# Altium schematic sheet WL-BPF_L.SchDoc
size 420 x 297 mm; Scale: 1:1; DocumentType: Схема электрическая принципиальная; FirstReferrence: АБВГ.123456.001; DocumentNumber: 11; SheetNumber: 12; SheetTotal: 12
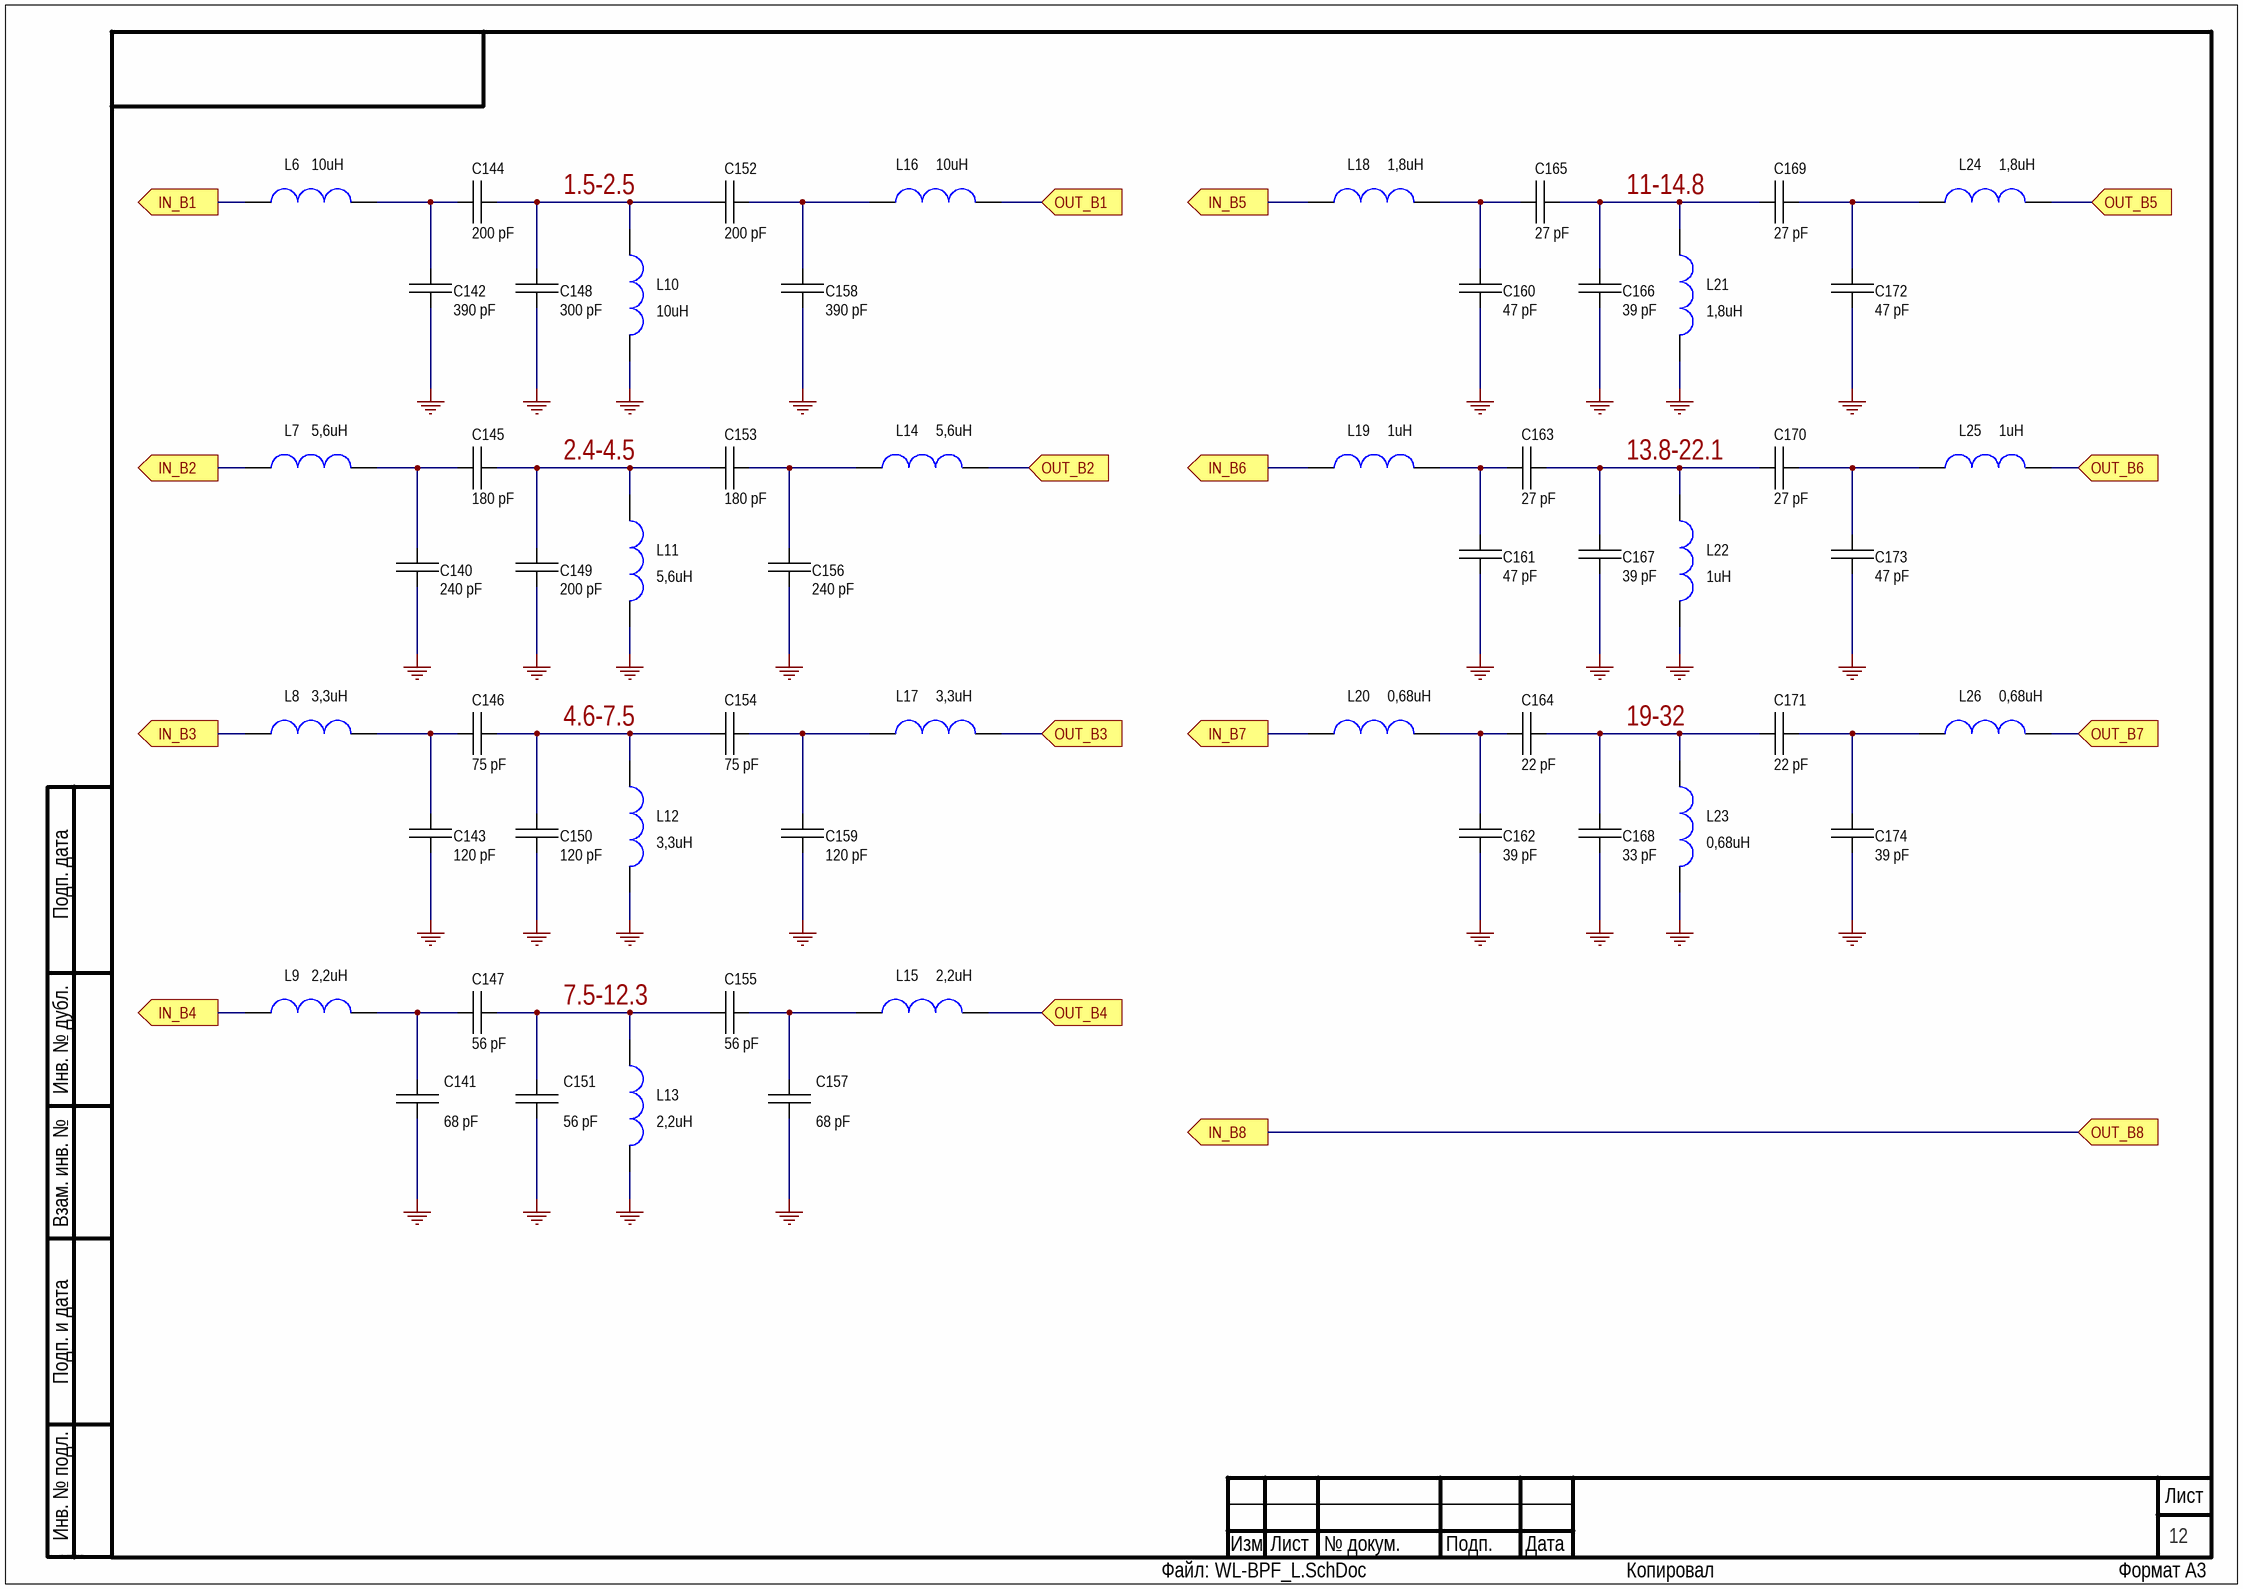
[diagram p0: WL-BPF_L.SchDoc]

## Parts
C140  240 pF  [C-0805-0.7]
C141  68 pF  [C-0805-0.7]
C142  390 pF  [C-0805-0.7]
C143  120 pF  [C-0805-0.7]
C144  200 pF  [C-0805-0.7]
C145  180 pF  [C-0805-0.7]
C146  75 pF  [C-0805-0.7]
C147  56 pF  [C-0805-0.7]
C148  300 pF  [C-0805-0.7]
C149  200 pF  [C-0805-0.7]
C150  120 pF  [C-0805-0.7]
C151  56 pF  [C-0805-0.7]
C152  200 pF  [C-0805-0.7]
C153  180 pF  [C-0805-0.7]
C154  75 pF  [C-0805-0.7]
C155  56 pF  [C-0805-0.7]
C156  240 pF  [C-0805-0.7]
C157  68 pF  [C-0805-0.7]
C158  390 pF  [C-0805-0.7]
C159  120 pF  [C-0805-0.7]
C160  47 pF  [C-0805-0.7]
C161  47 pF  [C-0805-0.7]
C162  39 pF  [C-0805-0.7]
C163  27 pF  [C-0805-0.7]
C164  22 pF  [C-0805-0.7]
C165  27 pF  [C-0805-0.7]
C166  39 pF  [C-0805-0.7]
C167  39 pF  [C-0805-0.7]
C168  33 pF  [C-0805-0.7]
C169  27 pF  [C-0805-0.7]
C170  27 pF  [C-0805-0.7]
C171  22 pF  [C-0805-0.7]
C172  47 pF  [C-0805-0.7]
C173  47 pF  [C-0805-0.7]
C174  39 pF  [C-0805-0.7]
L6  10uH  [L-1210]
L7  5,6uH  [L-1210]
L8  3,3uH  [L-1210]
L9  2,2uH  [L-1210]
L10  10uH  [L-1210]
L11  5,6uH  [L-1210]
L12  3,3uH  [L-1210]
L13  2,2uH  [L-1210]
L14  5,6uH  [L-1210]
L15  2,2uH  [L-1210]
L16  10uH  [L-1210]
L17  3,3uH  [L-1210]
L18  1,8uH  [L-1210]
L19  1uH  [L-1210]
L20  0,68uH  [L-1210]
L21  1,8uH  [L-1210]
L22  1uH  [L-1210]
L23  0,68uH  [L-1210]
L24  1,8uH  [L-1210]
L25  1uH  [L-1210]
L26  0,68uH  [L-1210]

## Ports
IN_B1 (out), IN_B2 (out), IN_B3 (out), IN_B4 (out), IN_B5 (out), IN_B6 (out), IN_B7 (out), IN_B8 (out), OUT_B1 (in), OUT_B2 (in), OUT_B3 (in), OUT_B4 (in), OUT_B5 (in), OUT_B6 (in), OUT_B7 (in), OUT_B8 (in)

## Nets
GND: C140.1 C141.1 C142.1 C143.1 C148.1 C149.1 C150.1 C151.1 C156.1 C157.1 C158.1 C159.1 C160.1 C161.1 C162.1 C166.1 C167.1 C168.1 C172.1 C173.1 C174.1 L10.2 L11.2 L12.2 L13.2 L21.2 L22.2 L23.2
IN_B1: L6.1 ; port IN_B1
IN_B2: L7.1 ; port IN_B2
IN_B3: L8.1 ; port IN_B3
IN_B4: L9.1 ; port IN_B4
IN_B5: L18.1 ; port IN_B5
IN_B6: L19.1 ; port IN_B6
IN_B7: L20.1 ; port IN_B7
IN_B8: port IN_B8, port OUT_B8
OUT_B1: L16.2 ; port OUT_B1
OUT_B2: L14.2 ; port OUT_B2
OUT_B3: L17.2 ; port OUT_B3
OUT_B4: L15.2 ; port OUT_B4
OUT_B5: L24.2 ; port OUT_B5
OUT_B6: L25.2 ; port OUT_B6
OUT_B7: L26.2 ; port OUT_B7
NetC140_2: C140.2 C145.1 L7.2
NetC141_2: C141.2 C147.2 L9.2
NetC142_2: C142.2 C144.1 L6.2
NetC143_2: C143.2 C146.1 L8.2
NetC144_2: C144.2 C148.2 C152.1 L10.1
NetC145_2: C145.2 C149.2 C153.1 L11.1
NetC146_2: C146.2 C150.2 C154.1 L12.1
NetC147_1: C147.1 C151.2 C155.2 L13.1
NetC152_2: C152.2 C158.2 L16.1
NetC153_2: C153.2 C156.2 L14.1
NetC154_2: C154.2 C159.2 L17.1
NetC155_1: C155.1 C157.2 L15.1
NetC160_2: C160.2 C165.1 L18.2
NetC161_2: C161.2 C163.1 L19.2
NetC162_2: C162.2 C164.1 L20.2
NetC163_2: C163.2 C167.2 C170.1 L22.1
NetC164_2: C164.2 C168.2 C171.1 L23.1
NetC165_2: C165.2 C166.2 C169.1 L21.1
NetC169_2: C169.2 C172.2 L24.1
NetC170_2: C170.2 C173.2 L25.1
NetC171_2: C171.2 C174.2 L26.1

## Notes on the sheet
- 1.5-2.5
- 11-14.8
- 2.4-4.5
- (near C170) 13.8-22.1
- 4.6-7.5
- 19-32
- 7.5-12.3
- Подп. дата
- Инв. № дубл.
- Взам. инв. №
- Подп. и дата
- Инв. № подл.
- Изм.
- Лист
- № докум.
- Подп.
- Дата
- ALTIUM GOSTBOM2.0 KEV
- Файл:
- Копировал
- Формат А3

## Library data of the parts
C140 C156 = CC0805JRNPO9BN241: Manufacturer: Yageo; Type: Конденсатор; Dielectric: NPO; Value: 240; Tolerance: ±5%; Voltage: 50 V; CommentDOC: ( CC - 0805 - NPO - 50 V - 240 pF ±5% ); Part Number: CC0805JRNPO9BN241; Units: pF; Case: 0805; Operating Temperature: -55 ... 125 °C; Series: CC; Value+Units: 240 pF; ValueSCH: 240 pF; ( Series - Case - Dielectric -  Voltage - Value+Units Tolerance: ( CC - 0805 - NPO - 50 V - 240 pF ±5% )
C141 C157 = CC0805JRNPO9BN680: Manufacturer: Yageo; Type: Конденсатор; Dielectric: NPO; Value: 68; Tolerance: ±5%; Voltage: 50 V; CommentDOC: ( CC - 0805 - NPO - 50 V - 68 pF ±5% ); Part Number: CC0805JRNPO9BN680; Units: pF; Case: 0805; Operating Temperature: -55 ... 125 °C; Series: CC; Value+Units: 68 pF; ValueSCH: 68 pF; ( Series - Case - Dielectric -  Voltage - Value+Units Tolerance: ( CC - 0805 - NPO - 50 V - 68 pF ±5% )
C142 C158 = CC0805JRNPO9BN391: Manufacturer: Yageo; Type: Конденсатор; Dielectric: NPO; Value: 390; Tolerance: ±5%; Voltage: 50 V; CommentDOC: ( CC - 0805 - NPO - 50 V - 390 pF ±5% ); Part Number: CC0805JRNPO9BN391; Units: pF; Case: 0805; Operating Temperature: -55 ... 125 °C; Series: CC; Value+Units: 390 pF; ValueSCH: 390 pF; ( Series - Case - Dielectric -  Voltage - Value+Units Tolerance: ( CC - 0805 - NPO - 50 V - 390 pF ±5% )
C143 C150 C159 = CC0805JRNPO9BN121: Manufacturer: Yageo; Type: Конденсатор; Dielectric: NPO; Value: 120; Tolerance: ±5%; Voltage: 50 V; CommentDOC: ( CC - 0805 - NPO - 50 V - 120 pF ±5% ); Part Number: CC0805JRNPO9BN121; Units: pF; Case: 0805; Operating Temperature: -55 ... 125 °C; Series: CC; Value+Units: 120 pF; ValueSCH: 120 pF; ( Series - Case - Dielectric -  Voltage - Value+Units Tolerance: ( CC - 0805 - NPO - 50 V - 120 pF ±5% )
C144 C149 C152 = CC0805JRNPO9BN201: Manufacturer: Yageo; Type: Конденсатор; Dielectric: NPO; Value: 200; Tolerance: ±5%; Voltage: 50 V; CommentDOC: ( CC - 0805 - NPO - 50 V - 200 pF ±5% ); Part Number: CC0805JRNPO9BN201; Units: pF; Case: 0805; Operating Temperature: -55 ... 125 °C; Series: CC; Value+Units: 200 pF; ValueSCH: 200 pF; ( Series - Case - Dielectric -  Voltage - Value+Units Tolerance: ( CC - 0805 - NPO - 50 V - 200 pF ±5% )
C145 C153 = CC0805JRNPO9BN181: Manufacturer: Yageo; Type: Конденсатор; Dielectric: NPO; Value: 180; Tolerance: ±5%; Voltage: 50 V; CommentDOC: ( CC - 0805 - NPO - 50 V - 180 pF ±5% ); Part Number: CC0805JRNPO9BN181; Units: pF; Case: 0805; Operating Temperature: -55 ... 125 °C; Series: CC; Value+Units: 180 pF; ValueSCH: 180 pF; ( Series - Case - Dielectric -  Voltage - Value+Units Tolerance: ( CC - 0805 - NPO - 50 V - 180 pF ±5% )
C146 C154 = CC0805JRNPO9BN750: Manufacturer: Yageo; Type: Конденсатор; Dielectric: NPO; Value: 75; Tolerance: ±5%; Voltage: 50 V; CommentDOC: ( CC - 0805 - NPO - 50 V - 75 pF ±5% ); Part Number: CC0805JRNPO9BN750; Units: pF; Case: 0805; Operating Temperature: -55 ... 125 °C; Series: CC; Value+Units: 75 pF; ValueSCH: 75 pF; ( Series - Case - Dielectric -  Voltage - Value+Units Tolerance: ( CC - 0805 - NPO - 50 V - 75 pF ±5% )
C147 C151 C155 = CC0805JRNPO9BN560: Manufacturer: Yageo; Type: Конденсатор; Dielectric: NPO; Value: 56; Tolerance: ±5%; Voltage: 50 V; CommentDOC: ( CC - 0805 - NPO - 50 V - 56 pF ±5% ); Part Number: CC0805JRNPO9BN560; Units: pF; Case: 0805; Operating Temperature: -55 ... 125 °C; Series: CC; Value+Units: 56 pF; ValueSCH: 56 pF; ( Series - Case - Dielectric -  Voltage - Value+Units Tolerance: ( CC - 0805 - NPO - 50 V - 56 pF ±5% )
C148 = CC0805JRNPO9BN301: Manufacturer: Yageo; Type: Конденсатор; Dielectric: NPO; Value: 300; Tolerance: ±5%; Voltage: 50 V; CommentDOC: ( CC - 0805 - NPO - 50 V - 300 pF ±5% ); Part Number: CC0805JRNPO9BN301; Units: pF; Case: 0805; Operating Temperature: -55 ... 125 °C; Series: CC; Value+Units: 300 pF; ValueSCH: 300 pF; ( Series - Case - Dielectric -  Voltage - Value+Units Tolerance: ( CC - 0805 - NPO - 50 V - 300 pF ±5% )
C160 C161 C172 C173 = CC0805JRNPO9BN470: Manufacturer: Yageo; Type: Конденсатор; Dielectric: NPO; Value: 47; Tolerance: ±5%; Voltage: 50 V; CommentDOC: ( CC - 0805 - NPO - 50 V - 47 pF ±5% ); Part Number: CC0805JRNPO9BN470; Units: pF; Case: 0805; Operating Temperature: -55 ... 125 °C; Series: CC; Value+Units: 47 pF; ValueSCH: 47 pF; ( Series - Case - Dielectric -  Voltage - Value+Units Tolerance: ( CC - 0805 - NPO - 50 V - 47 pF ±5% )
C162 C166 C167 C174 = CC0805JRNPO9BN390: Manufacturer: Yageo; Type: Конденсатор; Dielectric: NPO; Value: 39; Tolerance: ±5%; Voltage: 50 V; CommentDOC: ( CC - 0805 - NPO - 50 V - 39 pF ±5% ); Part Number: CC0805JRNPO9BN390; Units: pF; Case: 0805; Operating Temperature: -55 ... 125 °C; Series: CC; Value+Units: 39 pF; ValueSCH: 39 pF; ( Series - Case - Dielectric -  Voltage - Value+Units Tolerance: ( CC - 0805 - NPO - 50 V - 39 pF ±5% )
C163 C165 C169 C170 = CC0805JRNPO9BN270: Manufacturer: Yageo; Type: Конденсатор; Dielectric: NPO; Value: 27; Tolerance: ±5%; Voltage: 50 V; CommentDOC: ( CC - 0805 - NPO - 50 V - 27 pF ±5% ); Part Number: CC0805JRNPO9BN270; Units: pF; Case: 0805; Operating Temperature: -55 ... 125 °C; Series: CC; Value+Units: 27 pF; ValueSCH: 27 pF; ( Series - Case - Dielectric -  Voltage - Value+Units Tolerance: ( CC - 0805 - NPO - 50 V - 27 pF ±5% )
C164 C171 = CC0805JRNPO9BN220: Manufacturer: Yageo; Type: Конденсатор; Dielectric: NPO; Value: 22; Tolerance: ±5%; Voltage: 50 V; CommentDOC: ( CC - 0805 - NPO - 50 V - 22 pF ±5% ); Part Number: CC0805JRNPO9BN220; Units: pF; Case: 0805; Operating Temperature: -55 ... 125 °C; Series: CC; Value+Units: 22 pF; ValueSCH: 22 pF; ( Series - Case - Dielectric -  Voltage - Value+Units Tolerance: ( CC - 0805 - NPO - 50 V - 22 pF ±5% )
C168 = CC0805JRNPO9BN330: Manufacturer: Yageo; Type: Конденсатор; Dielectric: NPO; Value: 33; Tolerance: ±5%; Voltage: 50 V; CommentDOC: ( CC - 0805 - NPO - 50 V - 33 pF ±5% ); Part Number: CC0805JRNPO9BN330; Units: pF; Case: 0805; Operating Temperature: -55 ... 125 °C; Series: CC; Value+Units: 33 pF; ValueSCH: 33 pF; ( Series - Case - Dielectric -  Voltage - Value+Units Tolerance: ( CC - 0805 - NPO - 50 V - 33 pF ±5% )
L6 L10 L16 = FHW1210IF100JST: Manufacturer: FH(Guangdong Fenghua Advanced Tech); Type: Дроссель; Part Number: FHW1210IF100JST; Series: FHW; Case: 1210; ValueSCH: 10uH
L7 L11 L14 = FHW1210IF5R6JST: Manufacturer: FH(Guangdong Fenghua Advanced Tech); Type: Дроссель; Part Number: FHW1210IF5R6JST; Series: FHW; Case: 1210; ValueSCH: 5,6uH
L8 L12 L17 = FHW1210IF3R3JST: Manufacturer: FH(Guangdong Fenghua Advanced Tech); Type: Дроссель; Part Number: FHW1210IF3R3JST; Series: FHW; Case: 1210; ValueSCH: 3,3uH
L9 L13 L15 = FHW1210IF2R2JST: Manufacturer: FH(Guangdong Fenghua Advanced Tech); Type: Дроссель; Part Number: FHW1210IF2R2JST; Series: FHW; Case: 1210; ValueSCH: 2,2uH
L18 L21 L24 = FHW1210IF1R8JST: Manufacturer: FH(Guangdong Fenghua Advanced Tech); Type: Дроссель; Part Number: FHW1210IF1R8JST; Series: FHW; Case: 1210; ValueSCH: 1,8uH
L19 L22 L25 = FHW1210IF1R0KST: Manufacturer: FH(Guangdong Fenghua Advanced Tech); Type: Дроссель; Part Number: FHW1210IF1R0KST; Series: FHW; Case: 1210; ValueSCH: 1uH
L20 L23 L26 = FHW1210HCR68JGT: Manufacturer: FH(Guangdong Fenghua Advanced Tech); Type: Дроссель; Part Number: FHW1210HCR68JGT; Series: FHW; Case: 1210; ValueSCH: 0,68uH